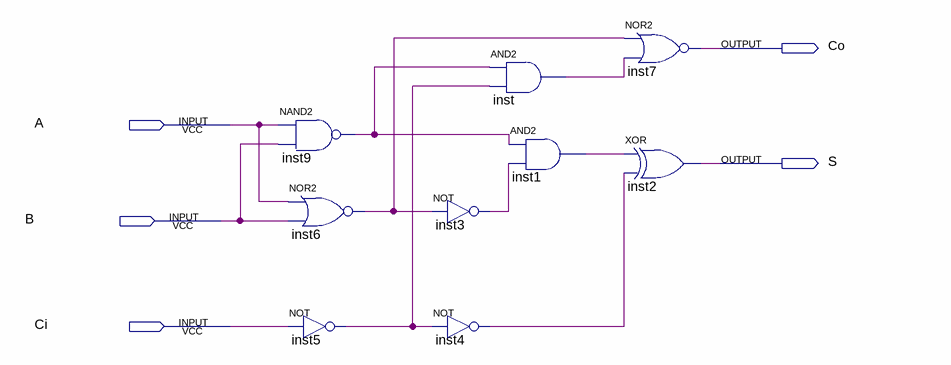
[diagram p0: schematic sheet]
// Quartus schematic Add1bit.bdf as structural Verilog: 9 symbols, 5 pins
module Add1bit (
  input  A,
  input  B,
  input  Ci,
  output Co,
  output S
);

  wire inst1_out, inst3_out, inst4_out, inst5_out, inst6_out, inst9_out, inst_out;

  nand inst9 (inst9_out, A, B);
  nor inst6 (inst6_out, A, B);
  not inst5 (inst5_out, Ci);
  not inst3 (inst3_out, inst6_out);
  not inst4 (inst4_out, inst5_out);
  and inst (inst_out, inst9_out, inst5_out);
  and inst1 (inst1_out, inst9_out, inst3_out);
  nor inst7 (Co, inst6_out, inst_out);
  xor inst2 (S, inst1_out, inst4_out);
endmodule
